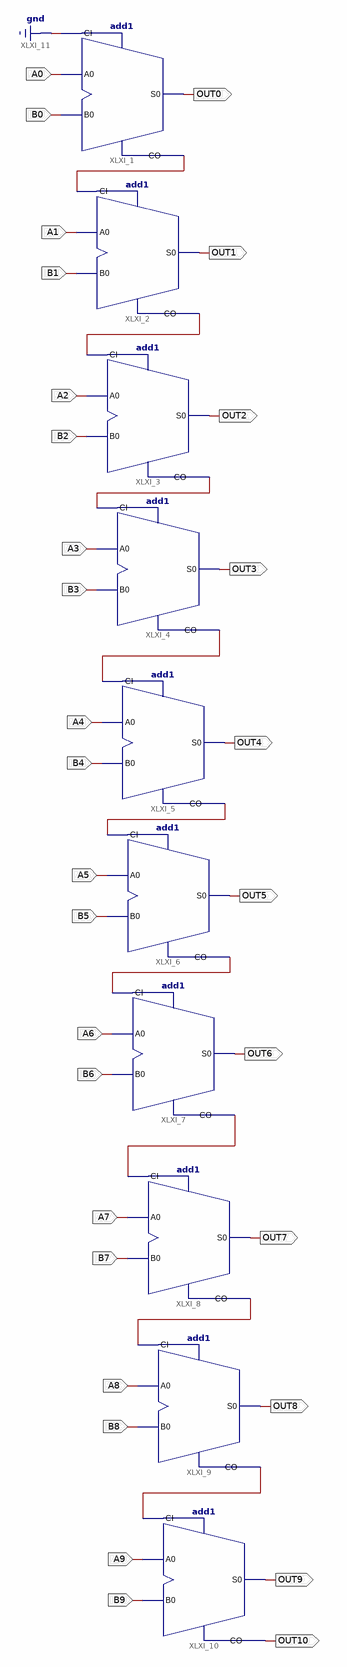
[diagram p0: schematic sheet 1]
// Xilinx ISE schematic Full_Adder10.sch (xc9500xl) as structural Verilog: 10 symbols, 31 ports
module Full_Adder10 (
  input  A9,
  input  B9,
  input  B8,
  input  A8,
  input  B7,
  input  A7,
  input  B6,
  input  A6,
  input  B5,
  input  A5,
  input  B4,
  input  A4,
  input  A3,
  input  B3,
  input  A2,
  input  B2,
  input  A1,
  input  B1,
  input  B0,
  input  A0,
  output OUT0,
  output OUT1,
  output OUT2,
  output OUT3,
  output OUT4,
  output OUT5,
  output OUT6,
  output OUT7,
  output OUT8,
  output OUT9,
  output OUT10
);

  wire XLXN_31, XLXN_32, XLXN_33, XLXN_34, XLXN_35, XLXN_36, XLXN_37, XLXN_38, XLXN_39;

  add1 XLXI_1 (.A0(A0), .B0(B0), .CI(1'b0), .CO(XLXN_32), .S0(OUT0));
  add1 XLXI_2 (.A0(A1), .B0(B1), .CI(XLXN_32), .CO(XLXN_31), .S0(OUT1));
  add1 XLXI_3 (.A0(A2), .B0(B2), .CI(XLXN_31), .CO(XLXN_33), .S0(OUT2));
  add1 XLXI_4 (.A0(A3), .B0(B3), .CI(XLXN_33), .CO(XLXN_34), .S0(OUT3));
  add1 XLXI_5 (.A0(A4), .B0(B4), .CI(XLXN_34), .CO(XLXN_35), .S0(OUT4));
  add1 XLXI_6 (.A0(A5), .B0(B5), .CI(XLXN_35), .CO(XLXN_36), .S0(OUT5));
  add1 XLXI_7 (.A0(A6), .B0(B6), .CI(XLXN_36), .CO(XLXN_37), .S0(OUT6));
  add1 XLXI_8 (.A0(A7), .B0(B7), .CI(XLXN_37), .CO(XLXN_38), .S0(OUT7));
  add1 XLXI_9 (.A0(A8), .B0(B8), .CI(XLXN_38), .CO(XLXN_39), .S0(OUT8));
  add1 XLXI_10 (.A0(A9), .B0(B9), .CI(XLXN_39), .CO(OUT10), .S0(OUT9));
endmodule
